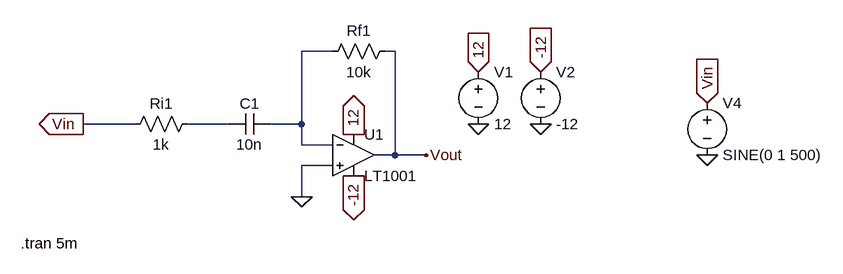
[diagram p0: schematic lab8.3.2.asc]
lab8.3.2.asc, the LTspice schematic file:
Version 4
SHEET 1 1016 680
WIRE -80 144 -128 144
WIRE 16 144 0 144
WIRE -384 256 -464 256
WIRE -240 256 -304 256
WIRE -128 256 -128 144
WIRE -128 256 -176 256
WIRE -128 288 -128 256
WIRE -80 288 -128 288
WIRE 16 304 16 144
WIRE 16 304 -16 304
WIRE 64 304 16 304
WIRE -80 320 -128 320
WIRE -128 368 -128 320
FLAG 144 256 0
FLAG 240 256 0
FLAG 144 176 12
IOPIN 144 176 In
FLAG -48 272 12
IOPIN -48 272 Out
FLAG 240 176 -12
IOPIN 240 176 In
FLAG -48 336 -12
IOPIN -48 336 Out
FLAG 496 224 Vin
IOPIN 496 224 In
FLAG -464 256 Vin
IOPIN -464 256 Out
FLAG 64 304 Vout
FLAG -128 368 0
FLAG 496 304 0
SYMBOL voltage 144 160 R0
SYMATTR InstName V1
SYMATTR Value 12
SYMBOL voltage 240 160 R0
SYMATTR InstName V2
SYMATTR Value -12
SYMBOL res 16 128 R90
WINDOW 0 0 56 VBottom 2
WINDOW 3 32 56 VTop 2
SYMATTR InstName Rf1
SYMATTR Value 10k
SYMBOL cap -176 240 R90
WINDOW 0 0 32 VBottom 2
WINDOW 3 32 32 VTop 2
SYMATTR InstName C1
SYMATTR Value 10n
SYMBOL Opamps\\LT1001 -48 240 R0
SYMATTR InstName U1
SYMBOL res -288 240 R90
WINDOW 0 0 56 VBottom 2
WINDOW 3 32 56 VTop 2
SYMATTR InstName Ri1
SYMATTR Value 1k
SYMBOL voltage 496 208 R0
WINDOW 123 0 0 Left 0
WINDOW 39 0 0 Left 0
SYMATTR InstName V4
SYMATTR Value SINE(0 1 500)
TEXT -560 440 Left 2 !.tran 5m

The netlist it stands for:
* lab8.3.2.asc
V1 12 0 12
V2 -12 0 -12
Rf1 Vout N001 10k
C1 N001 N002 10n
XU1 0 N001 12 -12 Vout LT1001  ; pins In+ In- V+ V- OUT
Ri1 N002 Vin 1k
V4 Vin 0 SINE(0 1 500)
.tran 5m
.lib LTC.lib
.backanno
.end